# EAGLE design piezo-buffer-and-preamp-ritter_V0-1alt (EAGLE 7.5.0)
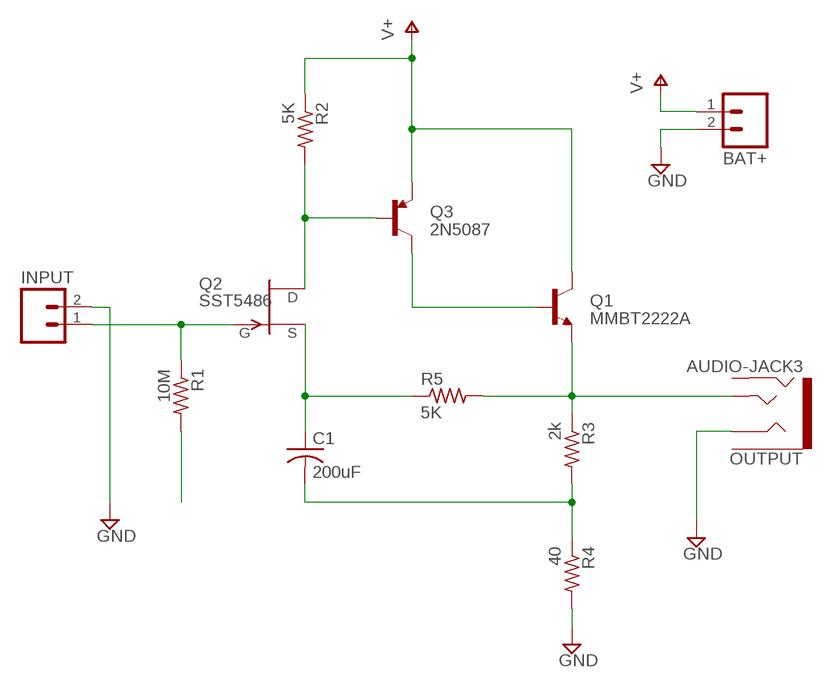
[diagram p0: schematic, sheet 1]

## Parts
BAT+  M02LOCK  [1X02_LOCK]
C1  200uF  C-USC0805  [C0805]
INPUT  M02LOCK  [1X02_LOCK]
OUTPUT  AUDIO-JACK3  [AUDIO-JACK-TRRS-SMD]
Q1  MMBT2222A  TRANSISTOR_NPN  [SOT23]
Q2  SST5486  [SOT23]
Q3  2N5087  TRANSISTOR_PNP  [SOT23]
R1  10M  R-US_R0805  [R0805]
R2  5K  R-US_R0805  [R0805]
R3  2k  R-US_R0805  [R0805]
R4  40  R-US_R0805  [R0805]
R5  5K  R-US_R0805  [R0805]

## Nets
GND: BAT+.2 INPUT.2 OUTPUT.RING1 R4.2
N$1: INPUT.1 Q2.3(G) R1.1
N$2: Q2.1(D) Q3.1(B) R2.2
N$3: OUTPUT.TIP Q1.2(E) R3.1 R5.2
N$4: C1.2 R3.2 R4.1
N$5: Q1.1(B) Q3.3(C)
N$6: C1.1 Q2.2(S) R5.1
N$7: R1.2
V+: BAT+.1 Q1.3(C) Q3.2(E) R2.1
Unconnected: OUTPUT.EARTH OUTPUT.RING2

## Library data of the parts
BAT+ INPUT = CMU-ArtFab:M02: Header 2 Standard 2-pin 0.1" header. Use with straight break away headers (SKU : PRT-00116), right angle break away headers (PRT-00553), swiss pins (PRT-00743), machine pins (PRT-00117), and female headers (PRT-00115). Molex polarized connector foot print use with SKU : PRT-08233 with associated crimp pins and housings.
C1 = rcl:C-US: CAPACITOR, American symbol
OUTPUT = SparkFun-Connectors:AUDIO-JACK3: Audio jack - 3.5mm TRRS variety - two rings.
Q1 = CMU-ArtFab:TRANSISTOR_NPN: Generic NPN BJT MMBT2222A - TRANS-08049 (SOT-23, 1A 40V) MPSA42 - TRANS-09116 (SOT-23, 500mA 300V) MMBT5088LT1G - TRANS-11160 (SOT-23, 50 mA 30V) BC547 - COM-08928 <http://www.sparkfun.com/products/8928> (TO-92 45V 100mA) (1.Collector 2.Base 3.Emitter) 2N3904 - COM-00521 <http://www.sparkfun.com/products/521> (TO-92 40V 200mA) (1.Emitter 2.Base 3.Collector) P2N2222A - COM-12852 <http://www.sparkfun.com/products/12852> (TO-92 40V 600mA) (1.Collector 2.Base 3.Emitter)
Q2 = transistor-fet:?548*: N-Channel JFETs Source: VISHAY 2N5484.pdf Compatible: TO92 2N5245 J304 J305 U310 J308 J309 J310 TO72 2N4416 2N4416A 2N3823 2N4351 3N169 3N170 3N171 MFE3002 TO18 2N3796 2N3797 MFE825 Source: Motorola European Master Guide Pacge 3-59
Q3 = CMU-ArtFab:TRANSISTOR_PNP: Generic PNP BJT Double check pinouts against datasheets- not all devices are the same! MMBT3906 - 40V 200mA SOT-23 (TRANS-08052) MMBT4403 - 40V 600mA SOT-23 (TRANS-09245)
R1-R5 = resistor:R-US_: RESISTOR, American symbol

## Board
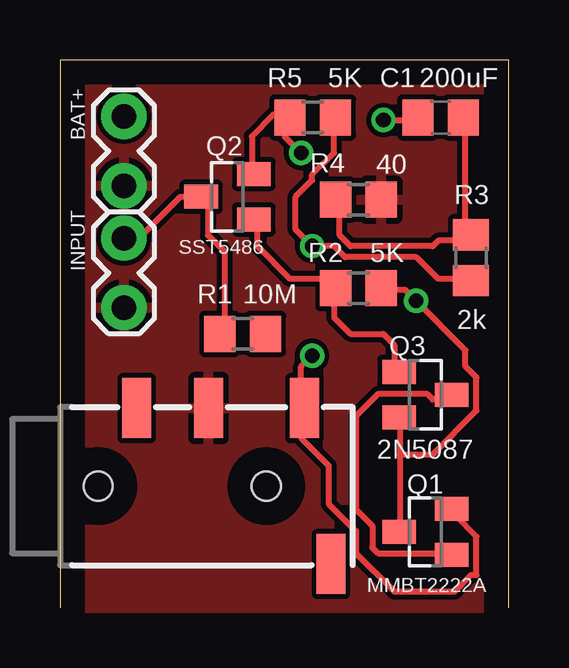
[diagram p1: board, top side]
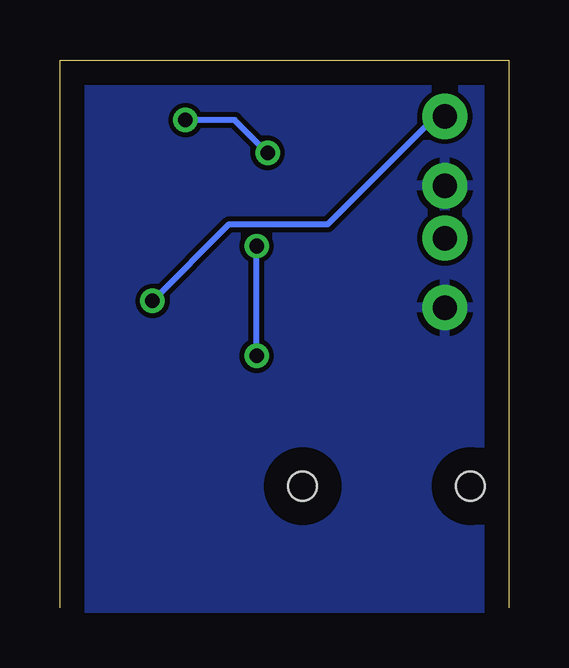
[diagram p2: board, bottom side, seen from below]

Size 18.72 x 22.85 mm. Coordinates in mm from the lower left corner, seen from the top.
Outline: 18.72,0 18.72,22.85 0,22.85 0,0
Copper layers (1*16): Top 0.035mm / dielectric 1.5mm / Bottom 0.035mm
Design rules "default": minimum track width 10mil, minimum drill 24mil, track to track 8mil, track to pad 8mil, pad to pad 8mil, via to via 8mil, smd to smd 8mil, copper to edge 40mil, drill to drill 8mil, minimum pad ring 10mil, minimum via ring 8mil, stop-mask expansion 4mil, vias tented up to drill 0mil, thermal gap 10mil

### Footprints (pad centres in the part's own frame; a part is rotated, then mirrored left to right if it is on the bottom)
1X02_LOCK = drill 1.016 pad 1.88: 1 -0.178,0; 2 2.718,0
C0805 = smd 1.3 x 1.5: 1 -0.95,0; 2 0.95,0
AUDIO-JACK-TRRS-SMD = smd 1.2 x 2.5: EARTH 11.3,-3.25; RING1 6.2,3.25; RING2 3.2,3.25; TIP 10.2,3.25 | hole 1.2: 1.6,0; 8.6,0
SOT23 = smd 1 x 1.4: 1 -0.95,-1.1; 2 0.95,-1.1; 3 0,1.1
R0805 = smd 1.3 x 1.5: 1 -0.95,0; 2 0.95,0

### Placement (x,y rotation side)
BAT+  2.67,20.32 270 top
C1  15.88,20.45 0 top
INPUT  2.67,15.24 270 top
OUTPUT  0,5.08 0 top
Q1  15.24,3.17 90 top
Q2  6.99,17.14 90 top
Q3  15.24,8.89 270 top
R1  7.62,11.43 0 top
R2  12.45,13.34 180 top
R3  17.14,14.61 90 top
R4  12.45,17.02 0 top
R5  10.54,20.45 0 top

### Tracks (layer width: path | path; a pad name or v marks a point on that pad's centre or on a via)
GND
  pour Top: 0,0 19.05,0 19.05,22.86 0,22.86
  pour Bottom: 0,22.86 19.05,22.86 19.05,0 0,0
N$1
  Top 0.254: INPUT.1 2.74,15.54 3.43,15.54 5.03,17.14 Q2.3 5.94,17.14 6.17,16.92 6.17,15.54 6.86,14.86 6.86,11.43 R1.1
N$2
  Top 0.254: Q3.1 13.95,10.06 13.95,10.97 13.49,11.43 12.12,11.43 11.43,12.12 11.43,13.26 R2.2 11.43,13.49 11.2,13.72 9.6,13.72 8.23,15.09 8.23,16 Q2.1
N$3  (via drill 0.61)
  Top 0.254: R5.2 11.43,20.34 11.43,18.97 10.52,18.06 10.52,17.83 9.83,17.14 9.83,15.77 v10.52,15.09 11.43,15.09 11.89,14.63 14.86,14.63 15.77,13.72 17.14,13.72 R3.1 | Q1.2 16.46,4.12 16.46,3.89 17.37,2.97 17.37,1.37 17.14,1.37 16.46,0.69 13.95,0.69 12.34,2.29 12.34,3.2 11.2,4.34 11.2,5.94 10.06,7.09 10.06,8.23 OUTPUT.TIP 10.06,8.46 10.06,10.06 v10.52,10.52
  Bottom 0.254: v10.52,10.52 v10.52,15.09
N$4
  Top 0.254: R4.1 11.66,16.92 11.66,15.54 12.12,15.09 15.54,15.09 15.77,15.32 16.92,15.32 R3.2 17.14,15.77 16.92,16 16.92,20.34 C1.2
N$5
  Top 0.254: Q1.1 16.23,2.29 13.26,2.29 13.03,2.52 13.03,3.43 12.34,4.12 12.34,8 13.26,8.91 15.32,8.91 15.54,8.69 16.23,8.69 Q3.3
N$6  (via drill 0.61)
  Top 0.254: Q2.2 8,18.29 8,19.66 8.91,20.57 9.37,20.57 R5.1 9.37,20.34 9.37,19.66 v10.06,18.97 | v13.49,20.34 14.86,20.34 C1.1
  Bottom 0.254: v13.49,20.34 11.43,20.34 v10.06,18.97
V+  (via drill 0.61)
  Top 0.254: 14.17,6.4 14.17,7.77 Q3.2 | 14.17,6.4 14.17,3.2 Q1.3 | 14.17,6.4 15.54,6.4 17.37,8.23 17.37,9.6 16.92,10.06 16.92,10.74 v14.86,12.8 14.4,13.26 13.49,13.26 R2.1
  Bottom 0.254: v14.86,12.8 11.66,16 7.54,16 3.2,20.34 2.74,20.34 BAT+.1